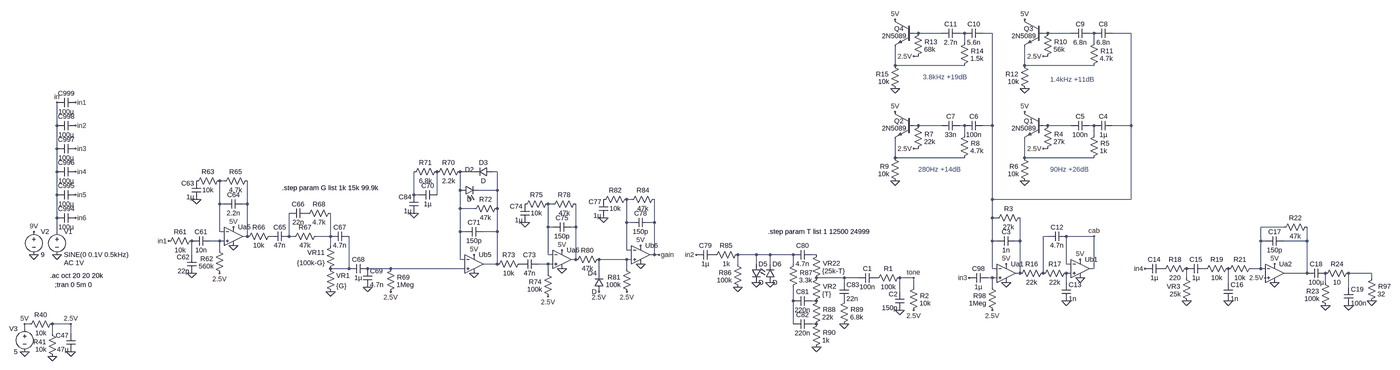
[diagram p0: schematic amPlug1ClassicRock.asc, whole sheet]
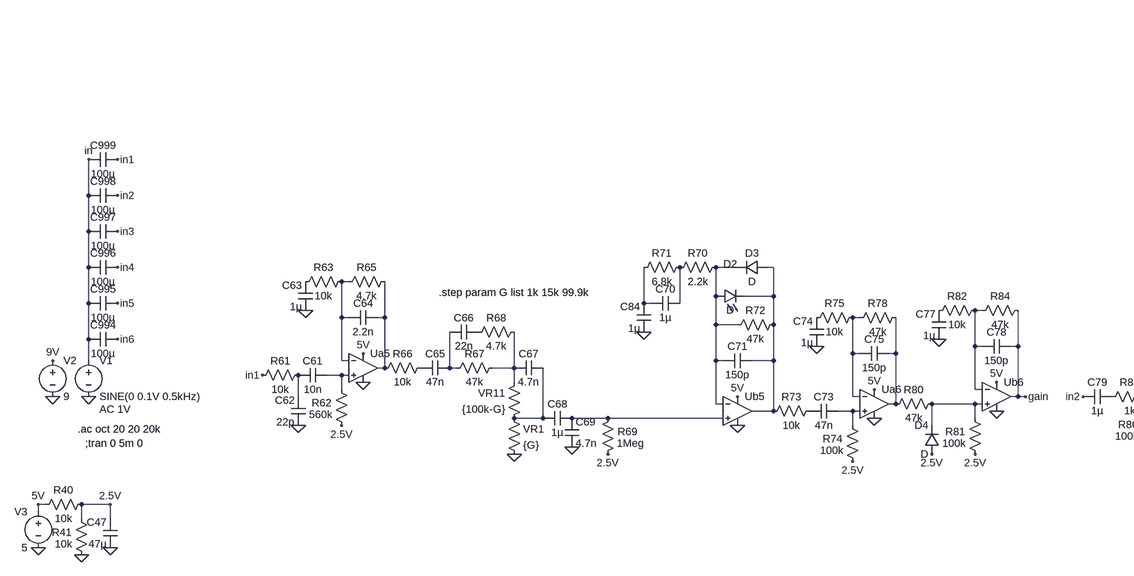
[diagram p1: schematic amPlug1ClassicRock.asc, part, row 1 of 1, column 1 of 2]
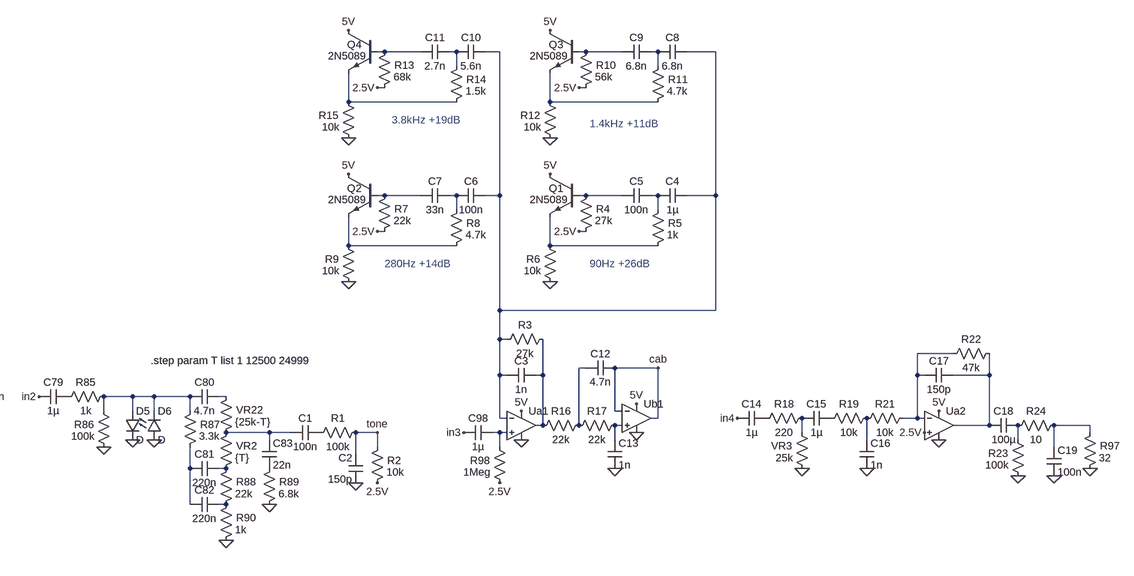
[diagram p2: schematic amPlug1ClassicRock.asc, part, row 1 of 1, column 2 of 2]
amPlug1ClassicRock.asc, the LTspice schematic file:
Version 4
SHEET 1 3408 3732
WIRE 1440 384 1424 384
WIRE 1520 384 1440 384
WIRE 1600 384 1584 384
WIRE 1696 384 1664 384
WIRE 1888 384 1872 384
WIRE 1968 384 1888 384
WIRE 2048 384 2032 384
WIRE 2176 384 2112 384
WIRE 1600 416 1600 384
WIRE 2048 416 2048 384
WIRE 1440 464 1424 464
WIRE 1888 464 1872 464
WIRE 1360 496 1360 432
WIRE 1600 496 1360 496
WIRE 1808 496 1808 432
WIRE 2048 496 1808 496
WIRE -1568 704 -1568 624
WIRE 1440 704 1424 704
WIRE 1520 704 1440 704
WIRE 1600 704 1584 704
WIRE 1696 704 1696 384
WIRE 1696 704 1664 704
WIRE 1888 704 1872 704
WIRE 1968 704 1888 704
WIRE 2048 704 2032 704
WIRE 2176 704 2176 384
WIRE 2176 704 2112 704
WIRE 1600 736 1600 704
WIRE 2048 736 2048 704
WIRE -1568 784 -1568 704
WIRE 1440 784 1424 784
WIRE 1888 784 1872 784
WIRE 1360 816 1360 752
WIRE 1600 816 1360 816
WIRE 1808 816 1808 752
WIRE 2048 816 1808 816
WIRE -1568 864 -1568 784
WIRE -96 864 -144 864
WIRE -16 864 -32 864
WIRE -960 896 -976 896
WIRE -144 928 -144 864
WIRE -16 928 -16 864
WIRE -16 928 -80 928
WIRE -1568 944 -1568 864
WIRE -304 944 -304 864
WIRE -288 944 -304 944
WIRE -224 944 -224 864
WIRE 448 960 432 960
WIRE 1696 960 1696 704
WIRE 2176 960 2176 704
WIRE 2176 960 1696 960
WIRE -976 976 -976 896
WIRE -960 976 -976 976
WIRE -880 976 -880 896
WIRE -880 976 -896 976
WIRE 176 976 160 976
WIRE -144 992 -144 928
WIRE -96 992 -144 992
WIRE -16 992 -16 928
WIRE -1568 1024 -1568 944
WIRE 1696 1024 1696 960
WIRE 1712 1024 1696 1024
WIRE 432 1040 432 960
WIRE 448 1040 432 1040
WIRE 528 1040 528 960
WIRE 528 1040 512 1040
WIRE 160 1056 160 976
WIRE 176 1056 160 1056
WIRE 256 1056 256 976
WIRE 256 1056 240 1056
WIRE 2704 1056 2624 1056
WIRE -1568 1072 -1568 1024
WIRE -976 1072 -976 976
WIRE -960 1072 -976 1072
WIRE -144 1072 -144 992
WIRE -128 1072 -144 1072
WIRE -16 1072 -16 992
WIRE -16 1072 -64 1072
WIRE -880 1088 -880 976
WIRE -880 1088 -896 1088
WIRE -736 1088 -736 1008
WIRE -720 1088 -736 1088
WIRE -592 1088 -592 1008
WIRE -592 1088 -640 1088
WIRE 1888 1088 1872 1088
WIRE 2048 1088 1952 1088
WIRE -976 1104 -1008 1104
WIRE -960 1104 -976 1104
WIRE 1696 1104 1696 1024
WIRE 1712 1104 1696 1104
WIRE 1792 1104 1792 1024
WIRE 1792 1104 1776 1104
WIRE 2624 1104 2624 1056
WIRE 2640 1104 2624 1104
WIRE 2784 1104 2784 1056
WIRE 2784 1104 2704 1104
WIRE -592 1120 -592 1088
WIRE -976 1136 -976 1104
WIRE 432 1136 432 1040
WIRE 448 1136 432 1136
WIRE -1072 1152 -1072 1104
WIRE 160 1152 160 1056
WIRE 176 1152 160 1152
WIRE 528 1152 528 1040
WIRE 528 1152 512 1152
WIRE 544 1152 528 1152
WIRE 880 1152 816 1152
WIRE 928 1152 880 1152
WIRE 1008 1152 928 1152
WIRE 1088 1152 1072 1152
WIRE -144 1168 -144 1072
WIRE -128 1168 -144 1168
WIRE 256 1168 256 1056
WIRE 256 1168 240 1168
WIRE 432 1168 336 1168
WIRE 448 1168 432 1168
WIRE -16 1184 -16 1072
WIRE -16 1184 -64 1184
WIRE 160 1184 128 1184
WIRE 176 1184 160 1184
WIRE 816 1184 816 1152
WIRE 880 1184 880 1152
WIRE 928 1184 928 1152
WIRE 1008 1184 1008 1152
WIRE 1952 1184 1952 1088
WIRE 1968 1184 1952 1184
WIRE -528 1200 -528 1088
WIRE -528 1200 -592 1200
WIRE -384 1200 -464 1200
WIRE -128 1200 -384 1200
WIRE 432 1200 432 1168
WIRE 1696 1200 1696 1104
WIRE 1712 1200 1696 1200
WIRE 2048 1200 2048 1088
WIRE 2048 1200 2032 1200
WIRE 2624 1200 2624 1104
WIRE 2624 1200 2592 1200
WIRE 2640 1200 2624 1200
WIRE 160 1216 160 1184
WIRE 336 1216 336 1168
WIRE 1792 1216 1792 1104
WIRE 1792 1216 1776 1216
WIRE 1872 1216 1872 1088
WIRE 1968 1216 1952 1216
WIRE 2784 1216 2784 1104
WIRE 2784 1216 2704 1216
WIRE 3008 1216 2928 1216
WIRE 1184 1232 1088 1232
WIRE 1232 1232 1184 1232
WIRE 1424 1232 1376 1232
WIRE 1696 1232 1680 1232
WIRE 1712 1232 1696 1232
WIRE 2368 1232 2368 1200
WIRE 3008 1232 3008 1216
WIRE 1184 1248 1184 1232
WIRE 1952 1248 1952 1216
WIRE 2512 1248 2512 1200
WIRE 2848 1248 2848 1216
WIRE 1424 1264 1424 1232
WIRE 1696 1264 1696 1232
WIRE 2928 1264 2928 1216
WIRE 1376 1280 1376 1232
WIRE 1008 1312 1008 1264
WIRE 1088 1312 1072 1312
WIRE -1664 1392 -1680 1392
WIRE -1520 1392 -1584 1392
WIRE 1008 1392 1008 1312
WIRE 1088 1392 1072 1392
WIRE -1680 1408 -1680 1392
WIRE -1584 1424 -1584 1392
WIRE -1520 1424 -1520 1392
FLAG -1568 1152 0
FLAG -1568 624 in
FLAG -1648 1152 0
FLAG -1648 1072 9V
FLAG -1504 624 in1
FLAG -1504 704 in2
FLAG -1504 784 in3
FLAG -1504 864 in4
FLAG -1504 944 in5
FLAG -1504 1024 in6
FLAG -1152 1104 in1
FLAG -928 1056 5V
FLAG -928 1120 0
FLAG -1584 1504 0
FLAG -1520 1488 0
FLAG -1520 1392 2.5V
FLAG -1056 960 0
FLAG -592 1280 0
FLAG -464 1264 0
FLAG -384 1280 2.5V
FLAG -1680 1488 0
FLAG -1680 1392 5V
FLAG -1072 1216 0
FLAG -976 1216 2.5V
FLAG -96 1152 5V
FLAG -96 1216 0
FLAG -304 1008 0
FLAG 208 1136 5V
FLAG 208 1200 0
FLAG 80 1040 0
FLAG 160 1296 2.5V
FLAG 1360 656 5V
FLAG 480 1184 0
FLAG 352 1024 0
FLAG 432 1280 2.5V
FLAG 336 1280 2.5V
FLAG 816 1264 0
FLAG 880 1248 0
FLAG 928 1248 0
FLAG 1088 1472 0
FLAG 1184 1392 0
FLAG 672 1152 in2
FLAG 1376 1344 0
FLAG 1424 1344 2.5V
FLAG 1744 1184 5V
FLAG 1744 1248 0
FLAG 1696 1344 2.5V
FLAG 1424 784 2.5V
FLAG 1360 896 0
FLAG 480 1120 5V
FLAG 1616 1232 in3
FLAG 1360 336 5V
FLAG 1424 464 2.5V
FLAG 1360 576 0
FLAG 1808 656 5V
FLAG 1872 784 2.5V
FLAG 1808 896 0
FLAG 1808 336 5V
FLAG 1872 464 2.5V
FLAG 1808 576 0
FLAG 2000 1168 5V
FLAG 2000 1232 0
FLAG 1952 1312 0
FLAG 2512 1312 0
FLAG 2368 1312 0
FLAG 2672 1184 5V
FLAG 2672 1248 0
FLAG 2640 1232 2.5V
FLAG 2848 1328 0
FLAG 2928 1328 0
FLAG 2224 1200 in4
FLAG 3008 1312 0
FLAG 544 1152 gain
FLAG 1424 1232 tone
FLAG 2048 1088 cab
SYMBOL voltage -1568 1056 R0
WINDOW 123 24 124 Left 2
WINDOW 39 0 0 Left 2
SYMATTR Value2 AC 1V
SYMATTR InstName V1
SYMATTR Value SINE(0 0.1V 0.5kHz)
SYMBOL voltage -1648 1056 R0
WINDOW 123 0 0 Left 0
WINDOW 39 0 0 Left 0
SYMATTR InstName V2
SYMATTR Value 9
SYMBOL cap -1504 688 R90
WINDOW 0 0 32 VBottom 2
WINDOW 3 32 32 VTop 2
SYMATTR InstName C998
SYMATTR Value 100µ
SYMBOL cap -1504 768 R90
WINDOW 0 0 32 VBottom 2
WINDOW 3 32 32 VTop 2
SYMATTR InstName C997
SYMATTR Value 100µ
SYMBOL cap -1504 848 R90
WINDOW 0 0 32 VBottom 2
WINDOW 3 32 32 VTop 2
SYMATTR InstName C996
SYMATTR Value 100µ
SYMBOL cap -1504 608 R90
WINDOW 0 0 32 VBottom 2
WINDOW 3 32 32 VTop 2
SYMATTR InstName C999
SYMATTR Value 100µ
SYMBOL cap -1504 928 R90
WINDOW 0 0 32 VBottom 2
WINDOW 3 32 32 VTop 2
SYMATTR InstName C995
SYMATTR Value 100µ
SYMBOL cap -1504 1008 R90
WINDOW 0 0 32 VBottom 2
WINDOW 3 32 32 VTop 2
SYMATTR InstName C994
SYMATTR Value 100µ
SYMBOL cap -1008 1088 R90
WINDOW 0 0 32 VBottom 2
WINDOW 3 32 32 VTop 2
SYMATTR InstName C61
SYMATTR Value 10n
SYMBOL res -1056 1088 R90
WINDOW 0 0 56 VBottom 2
WINDOW 3 32 56 VTop 2
SYMATTR InstName R61
SYMATTR Value 10k
SYMBOL Opamps\\UniversalOpamp2 -928 1088 R0
SYMATTR InstName Ua5
SYMBOL cap -896 960 R90
WINDOW 0 0 32 VBottom 2
WINDOW 3 32 32 VTop 2
SYMATTR InstName C64
SYMATTR Value 2.2n
SYMBOL res -864 880 R90
WINDOW 0 0 56 VBottom 2
WINDOW 3 32 56 VTop 2
SYMATTR InstName R65
SYMATTR Value 4.7k
SYMBOL res -1568 1376 R90
WINDOW 0 0 56 VBottom 2
WINDOW 3 32 56 VTop 2
SYMATTR InstName R40
SYMATTR Value 10k
SYMBOL res -1568 1520 R180
WINDOW 0 38 66 Left 2
WINDOW 3 36 40 Left 2
SYMATTR InstName R41
SYMATTR Value 10k
SYMBOL cap -1504 1488 R180
WINDOW 0 24 56 Left 2
WINDOW 3 24 8 Left 2
SYMATTR InstName C47
SYMATTR Value 47µ
SYMBOL res -960 1232 R180
WINDOW 0 38 66 Left 2
WINDOW 3 36 40 Left 2
SYMATTR InstName R62
SYMATTR Value 560k
SYMBOL res -960 880 R90
WINDOW 0 0 56 VBottom 2
WINDOW 3 32 56 VTop 2
SYMATTR InstName R63
SYMATTR Value 10k
SYMBOL cap -1040 960 R180
WINDOW 0 24 56 Left 2
WINDOW 3 24 8 Left 2
SYMATTR InstName C63
SYMATTR Value 1µ
SYMBOL npn 1424 656 M0
WINDOW 0 35 32 Left 2
WINDOW 3 25 57 Left 2
SYMATTR InstName Q2
SYMATTR Value 2N5089
SYMBOL res -784 1072 R90
WINDOW 0 0 56 VBottom 2
WINDOW 3 32 56 VTop 2
SYMATTR InstName R66
SYMATTR Value 10k
SYMBOL cap -736 1072 R90
WINDOW 0 0 32 VBottom 2
WINDOW 3 32 32 VTop 2
SYMATTR InstName C65
SYMATTR Value 47n
SYMBOL res -624 1072 R90
WINDOW 0 0 56 VBottom 2
WINDOW 3 32 56 VTop 2
SYMATTR InstName R67
SYMATTR Value 47k
SYMBOL cap -672 992 R90
WINDOW 0 0 32 VBottom 2
WINDOW 3 32 32 VTop 2
SYMATTR InstName C66
SYMATTR Value 22n
SYMBOL res -576 992 R90
WINDOW 0 0 56 VBottom 2
WINDOW 3 32 56 VTop 2
SYMATTR InstName R68
SYMATTR Value 4.7k
SYMBOL cap -528 1072 R90
WINDOW 0 0 32 VBottom 2
WINDOW 3 32 32 VTop 2
SYMATTR InstName C67
SYMATTR Value 4.7n
SYMBOL res -576 1104 M0
SYMATTR InstName VR11
SYMATTR Value {100k-G}
SYMBOL res -608 1184 R0
SYMATTR InstName VR1
SYMATTR Value {G}
SYMBOL cap -464 1184 R90
WINDOW 0 0 32 VBottom 2
WINDOW 3 32 32 VTop 2
SYMATTR InstName C68
SYMATTR Value 1µ
SYMBOL cap -480 1264 M180
WINDOW 0 24 56 Left 2
WINDOW 3 24 8 Left 2
SYMATTR InstName C69
SYMATTR Value 4.7n
SYMBOL res -400 1296 M180
WINDOW 0 38 66 Left 2
WINDOW 3 36 40 Left 2
SYMATTR InstName R69
SYMATTR Value 1Meg
SYMBOL voltage -1680 1392 M0
WINDOW 123 0 0 Left 0
WINDOW 39 0 0 Left 0
SYMATTR InstName V3
SYMATTR Value 5
SYMBOL cap -1056 1216 R180
WINDOW 0 24 56 Left 2
WINDOW 3 24 8 Left 2
SYMATTR InstName C62
SYMATTR Value 22p
SYMBOL Opamps\\UniversalOpamp2 -96 1184 R0
SYMATTR InstName Ub5
SYMBOL cap -64 1056 R90
WINDOW 0 0 32 VBottom 2
WINDOW 3 32 32 VTop 2
SYMATTR InstName C71
SYMATTR Value 150p
SYMBOL res 0 976 R90
WINDOW 0 0 56 VBottom 2
WINDOW 3 32 56 VTop 2
SYMATTR InstName R72
SYMATTR Value 47k
SYMBOL res -128 848 R90
WINDOW 0 0 56 VBottom 2
WINDOW 3 32 56 VTop 2
SYMATTR InstName R70
SYMATTR Value 2.2k
SYMBOL cap -288 1008 R180
WINDOW 0 24 56 Left 2
WINDOW 3 24 8 Left 2
SYMATTR InstName C84
SYMATTR Value 1µ
SYMBOL diode -32 848 R90
WINDOW 0 0 32 VBottom 2
WINDOW 3 32 32 VTop 2
SYMATTR InstName D3
SYMBOL LED -144 944 R270
WINDOW 0 72 32 VTop 2
WINDOW 3 0 32 VBottom 2
SYMATTR InstName D2
SYMBOL cap -288 960 R270
WINDOW 0 32 32 VTop 2
WINDOW 3 0 32 VBottom 2
SYMATTR InstName C70
SYMATTR Value 1µ
SYMBOL res -208 848 R90
WINDOW 0 0 56 VBottom 2
WINDOW 3 32 56 VTop 2
SYMATTR InstName R71
SYMATTR Value 6.8k
SYMBOL cap 128 1168 R90
WINDOW 0 0 32 VBottom 2
WINDOW 3 32 32 VTop 2
SYMATTR InstName C73
SYMATTR Value 47n
SYMBOL Opamps\\UniversalOpamp2 208 1168 R0
SYMATTR InstName Ua6
SYMBOL cap 240 1040 R90
WINDOW 0 0 32 VBottom 2
WINDOW 3 32 32 VTop 2
SYMATTR InstName C75
SYMATTR Value 150p
SYMBOL res 272 960 R90
WINDOW 0 0 56 VBottom 2
WINDOW 3 32 56 VTop 2
SYMATTR InstName R78
SYMATTR Value 47k
SYMBOL res 176 1312 R180
WINDOW 0 38 66 Left 2
WINDOW 3 36 40 Left 2
SYMATTR InstName R74
SYMATTR Value 100k
SYMBOL res 176 960 R90
WINDOW 0 0 56 VBottom 2
WINDOW 3 32 56 VTop 2
SYMATTR InstName R75
SYMATTR Value 10k
SYMBOL cap 96 1040 R180
WINDOW 0 24 56 Left 2
WINDOW 3 24 8 Left 2
SYMATTR InstName C74
SYMATTR Value 1µ
SYMBOL res 80 1168 R90
WINDOW 0 0 56 VBottom 2
WINDOW 3 32 56 VTop 2
SYMATTR InstName R73
SYMATTR Value 10k
SYMBOL Opamps\\UniversalOpamp2 480 1152 R0
SYMATTR InstName Ub6
SYMBOL cap 512 1024 R90
WINDOW 0 0 32 VBottom 2
WINDOW 3 32 32 VTop 2
SYMATTR InstName C78
SYMATTR Value 150p
SYMBOL res 544 944 R90
WINDOW 0 0 56 VBottom 2
WINDOW 3 32 56 VTop 2
SYMATTR InstName R84
SYMATTR Value 47k
SYMBOL res 448 1296 R180
WINDOW 0 38 66 Left 2
WINDOW 3 36 40 Left 2
SYMATTR InstName R81
SYMATTR Value 100k
SYMBOL res 448 944 R90
WINDOW 0 0 56 VBottom 2
WINDOW 3 32 56 VTop 2
SYMATTR InstName R82
SYMATTR Value 10k
SYMBOL cap 368 1024 R180
WINDOW 0 24 56 Left 2
WINDOW 3 24 8 Left 2
SYMATTR InstName C77
SYMATTR Value 1µ
SYMBOL diode 352 1280 R180
WINDOW 0 24 64 Left 2
WINDOW 3 24 0 Left 2
SYMATTR InstName D4
SYMBOL res 352 1152 R90
WINDOW 0 0 56 VBottom 2
WINDOW 3 32 56 VTop 2
SYMATTR InstName R80
SYMATTR Value 47k
SYMBOL cap 736 1136 R90
WINDOW 0 0 32 VBottom 2
WINDOW 3 32 32 VTop 2
SYMATTR InstName C79
SYMATTR Value 1µ
SYMBOL res 832 1136 R90
WINDOW 0 0 56 VBottom 2
WINDOW 3 32 56 VTop 2
SYMATTR InstName R85
SYMATTR Value 1k
SYMBOL res 832 1280 R180
WINDOW 0 38 66 Left 2
WINDOW 3 36 40 Left 2
SYMATTR InstName R86
SYMATTR Value 100k
SYMBOL diode 864 1184 R0
SYMATTR InstName D5
SYMBOL LED 912 1248 M180
WINDOW 0 24 64 Left 2
WINDOW 3 24 0 Left 2
SYMATTR InstName D6
SYMBOL cap 1072 1136 R90
WINDOW 0 0 32 VBottom 2
WINDOW 3 32 32 VTop 2
SYMATTR InstName C80
SYMATTR Value 4.7n
SYMBOL res 992 1280 M180
WINDOW 0 38 66 Left 2
WINDOW 3 36 40 Left 2
SYMATTR InstName R87
SYMATTR Value 3.3k
SYMBOL cap 1072 1296 R90
WINDOW 0 0 32 VBottom 2
WINDOW 3 32 32 VTop 2
SYMATTR InstName C81
SYMATTR Value 220n
SYMBOL cap 1072 1376 R90
WINDOW 0 0 32 VBottom 2
WINDOW 3 32 32 VTop 2
SYMATTR InstName C82
SYMATTR Value 220n
SYMBOL res 1072 1408 M180
WINDOW 0 38 66 Left 2
WINDOW 3 36 40 Left 2
SYMATTR InstName R88
SYMATTR Value 22k
SYMBOL res 1072 1488 M180
WINDOW 0 38 66 Left 2
WINDOW 3 36 40 Left 2
SYMATTR InstName R90
SYMATTR Value 1k
SYMBOL res 1072 1328 M180
WINDOW 0 38 66 Left 2
WINDOW 3 36 40 Left 2
SYMATTR InstName VR2
SYMATTR Value {T}
SYMBOL res 1072 1248 M180
WINDOW 0 38 66 Left 2
WINDOW 3 36 40 Left 2
SYMATTR InstName VR22
SYMATTR Value {25k-T}
SYMBOL cap 1168 1312 M180
WINDOW 0 24 56 Left 2
WINDOW 3 24 8 Left 2
SYMATTR InstName C83
SYMATTR Value 22n
SYMBOL res 1168 1408 M180
WINDOW 0 38 66 Left 2
WINDOW 3 36 40 Left 2
SYMATTR InstName R89
SYMATTR Value 6.8k
SYMBOL cap 1296 1216 R90
WINDOW 0 0 32 VBottom 2
WINDOW 3 32 32 VTop 2
SYMATTR InstName C1
SYMATTR Value 100n
SYMBOL res 1392 1216 R90
WINDOW 0 0 56 VBottom 2
WINDOW 3 32 56 VTop 2
SYMATTR InstName R1
SYMATTR Value 100k
SYMBOL cap 1392 1344 R180
WINDOW 0 24 56 Left 2
WINDOW 3 24 8 Left 2
SYMATTR InstName C2
SYMATTR Value 150p
SYMBOL res 1408 1360 M180
WINDOW 0 38 66 Left 2
WINDOW 3 36 40 Left 2
SYMATTR InstName R2
SYMATTR Value 10k
SYMBOL Opamps\\UniversalOpamp2 1744 1216 R0
SYMATTR InstName Ua1
SYMBOL cap 1776 1088 R90
WINDOW 0 0 32 VBottom 2
WINDOW 3 32 32 VTop 2
SYMATTR InstName C3
SYMATTR Value 1n
SYMBOL res 1808 1008 R90
WINDOW 0 0 56 VBottom 2
WINDOW 3 32 56 VTop 2
SYMATTR InstName R3
SYMATTR Value 27k
SYMBOL res 1712 1360 R180
WINDOW 0 38 66 Left 2
WINDOW 3 36 40 Left 2
SYMATTR InstName R98
SYMATTR Value 1Meg
SYMBOL cap 1680 1216 R90
WINDOW 0 0 32 VBottom 2
WINDOW 3 32 32 VTop 2
SYMATTR InstName C98
SYMATTR Value 1µ
SYMBOL res 1376 912 R180
WINDOW 0 38 66 Left 2
WINDOW 3 36 40 Left 2
SYMATTR InstName R9
SYMATTR Value 10k
SYMBOL res 1424 800 M180
WINDOW 0 38 66 Left 2
WINDOW 3 36 40 Left 2
SYMATTR InstName R7
SYMATTR Value 22k
SYMBOL cap 1584 688 R90
WINDOW 0 0 32 VBottom 2
WINDOW 3 32 32 VTop 2
SYMATTR InstName C7
SYMATTR Value 33n
SYMBOL cap 1664 688 R90
WINDOW 0 0 32 VBottom 2
WINDOW 3 32 32 VTop 2
SYMATTR InstName C6
SYMATTR Value 100n
SYMBOL res 1584 832 M180
WINDOW 0 38 66 Left 2
WINDOW 3 36 40 Left 2
SYMATTR InstName R8
SYMATTR Value 4.7k
SYMBOL npn 1424 336 M0
WINDOW 0 35 32 Left 2
WINDOW 3 25 57 Left 2
SYMATTR InstName Q4
SYMATTR Value 2N5089
SYMBOL res 1376 592 R180
WINDOW 0 38 66 Left 2
WINDOW 3 36 40 Left 2
SYMATTR InstName R15
SYMATTR Value 10k
SYMBOL res 1424 480 M180
WINDOW 0 38 66 Left 2
WINDOW 3 36 40 Left 2
SYMATTR InstName R13
SYMATTR Value 68k
SYMBOL cap 1584 368 R90
WINDOW 0 0 32 VBottom 2
WINDOW 3 32 32 VTop 2
SYMATTR InstName C11
SYMATTR Value 2.7n
SYMBOL cap 1664 368 R90
WINDOW 0 0 32 VBottom 2
WINDOW 3 32 32 VTop 2
SYMATTR InstName C10
SYMATTR Value 5.6n
SYMBOL res 1584 512 M180
WINDOW 0 38 66 Left 2
WINDOW 3 36 40 Left 2
SYMATTR InstName R14
SYMATTR Value 1.5k
SYMBOL npn 1872 656 M0
WINDOW 0 35 32 Left 2
WINDOW 3 25 57 Left 2
SYMATTR InstName Q1
SYMATTR Value 2N5089
SYMBOL res 1824 912 R180
WINDOW 0 38 66 Left 2
WINDOW 3 36 40 Left 2
SYMATTR InstName R6
SYMATTR Value 10k
SYMBOL res 1872 800 M180
WINDOW 0 38 66 Left 2
WINDOW 3 36 40 Left 2
SYMATTR InstName R4
SYMATTR Value 27k
SYMBOL cap 2032 688 R90
WINDOW 0 0 32 VBottom 2
WINDOW 3 32 32 VTop 2
SYMATTR InstName C5
SYMATTR Value 100n
SYMBOL cap 2112 688 R90
WINDOW 0 0 32 VBottom 2
WINDOW 3 32 32 VTop 2
SYMATTR InstName C4
SYMATTR Value 1µ
SYMBOL res 2032 832 M180
WINDOW 0 38 66 Left 2
WINDOW 3 36 40 Left 2
SYMATTR InstName R5
SYMATTR Value 1k
SYMBOL npn 1872 336 M0
WINDOW 0 35 32 Left 2
WINDOW 3 25 57 Left 2
SYMATTR InstName Q3
SYMATTR Value 2N5089
SYMBOL res 1824 592 R180
WINDOW 0 38 66 Left 2
WINDOW 3 36 40 Left 2
SYMATTR InstName R12
SYMATTR Value 10k
SYMBOL res 1872 480 M180
WINDOW 0 38 66 Left 2
WINDOW 3 36 40 Left 2
SYMATTR InstName R10
SYMATTR Value 56k
SYMBOL cap 2032 368 R90
WINDOW 0 0 32 VBottom 2
WINDOW 3 32 32 VTop 2
SYMATTR InstName C9
SYMATTR Value 6.8n
SYMBOL cap 2112 368 R90
WINDOW 0 0 32 VBottom 2
WINDOW 3 32 32 VTop 2
SYMATTR InstName C8
SYMATTR Value 6.8n
SYMBOL res 2032 512 M180
WINDOW 0 38 66 Left 2
WINDOW 3 36 40 Left 2
SYMATTR InstName R11
SYMATTR Value 4.7k
SYMBOL Opamps\\UniversalOpamp2 2000 1200 R0
SYMATTR InstName Ub1
SYMBOL cap 1936 1312 M180
WINDOW 0 24 56 Left 2
WINDOW 3 24 8 Left 2
SYMATTR InstName C13
SYMATTR Value 1n
SYMBOL cap 1952 1072 R90
WINDOW 0 0 32 VBottom 2
WINDOW 3 32 32 VTop 2
SYMATTR InstName C12
SYMATTR Value 4.7n
SYMBOL res 1968 1200 R90
WINDOW 0 0 56 VBottom 2
WINDOW 3 32 56 VTop 2
SYMATTR InstName R17
SYMATTR Value 22k
SYMBOL res 1888 1200 R90
WINDOW 0 0 56 VBottom 2
WINDOW 3 32 56 VTop 2
SYMATTR InstName R16
SYMATTR Value 22k
SYMBOL cap 2432 1184 R90
WINDOW 0 0 32 VBottom 2
WINDOW 3 32 32 VTop 2
SYMATTR InstName C15
SYMATTR Value 1µ
SYMBOL res 2528 1184 R90
WINDOW 0 0 56 VBottom 2
WINDOW 3 32 56 VTop 2
SYMATTR InstName R19
SYMATTR Value 10k
SYMBOL res 2608 1184 R90
WINDOW 0 0 56 VBottom 2
WINDOW 3 32 56 VTop 2
SYMATTR InstName R21
SYMATTR Value 10k
SYMBOL cap 2496 1312 M180
WINDOW 0 24 56 Left 2
WINDOW 3 24 8 Left 2
SYMATTR InstName C16
SYMATTR Value 1n
SYMBOL res 2384 1184 R90
WINDOW 0 0 56 VBottom 2
WINDOW 3 32 56 VTop 2
SYMATTR InstName R18
SYMATTR Value 220
SYMBOL cap 2288 1184 R90
WINDOW 0 0 32 VBottom 2
WINDOW 3 32 32 VTop 2
SYMATTR InstName C14
SYMATTR Value 1µ
SYMBOL res 2384 1328 R180
WINDOW 0 38 66 Left 2
WINDOW 3 36 40 Left 2
SYMATTR InstName VR3
SYMATTR Value 25k
SYMBOL Opamps\\UniversalOpamp2 2672 1216 R0
SYMATTR InstName Ua2
SYMBOL cap 2704 1088 R90
WINDOW 0 0 32 VBottom 2
WINDOW 3 32 32 VTop 2
SYMATTR InstName C17
SYMATTR Value 150p
SYMBOL res 2800 1040 R90
WINDOW 0 0 56 VBottom 2
WINDOW 3 32 56 VTop 2
SYMATTR InstName R22
SYMATTR Value 47k
SYMBOL cap 2848 1200 R90
WINDOW 0 0 32 VBottom 2
WINDOW 3 32 32 VTop 2
SYMATTR InstName C18
SYMATTR Value 100µ
SYMBOL res 2864 1344 R180
WINDOW 0 38 66 Left 2
WINDOW 3 36 40 Left 2
SYMATTR InstName R23
SYMATTR Value 100k
SYMBOL res 2944 1200 R90
WINDOW 0 0 56 VBottom 2
WINDOW 3 32 56 VTop 2
SYMATTR InstName R24
SYMATTR Value 10
SYMBOL cap 2912 1328 M180
WINDOW 0 24 56 Left 2
WINDOW 3 24 8 Left 2
SYMATTR InstName C19
SYMATTR Value 100n
SYMBOL res 2992 1328 M180
WINDOW 0 38 66 Left 2
WINDOW 3 36 40 Left 2
SYMATTR InstName R97
SYMATTR Value 32
TEXT -1592 1224 Left 2 !.ac oct 20 20 20k
TEXT -1576 1256 Left 2 !;tran 0 5m 0
TEXT -760 920 Left 2 !.step param G list 1k 15k 99.9k
TEXT 920 1072 Left 2 !.step param T list 1 12500 24999
TEXT 1896 856 Left 2 ;90Hz +26dB
TEXT 1440 856 Left 2 ;280Hz +14dB
TEXT 1456 536 Left 2 ;3.8kHz +19dB
TEXT 1896 544 Left 2 ;1.4kHz +11dB

The netlist it stands for:
* amPlug1ClassicRock.asc
V1 in 0 SINE(0 0.1V 0.5kHz) AC 1V
V2 9V 0 9
C998 in2 in 100µ
C997 in3 in 100µ
C996 in4 in 100µ
C999 in1 in 100µ
C995 in5 in 100µ
C994 in6 in 100µ
C61 N027 N030 10n
R61 N030 in1 10k
XUa5 N027 N016 5V 0 N020 level.2 Avol=1Meg GBW=10Meg Slew=10Meg ilimit=25m rail=0 Vos=0 phimargin=45 en=0 enk=0 in=0 ink=0 Rin=500Meg  ; pins IN+ IN- V+ V- OUT
C64 N020 N016 2.2n
R65 N020 N016 4.7k
R40 2.5V 5V 10k
R41 0 2.5V 10k
C47 0 2.5V 47µ
R62 2.5V N027 560k
R63 N016 P001 10k
C63 0 P001 1µ
Q2 5V N008 N012 0 2N5089
R66 P002 N020 10k
C65 N024 P002 47n
R67 N025 N024 47k
C66 P003 N024 22n
R68 N025 P003 4.7k
C67 N035 N025 4.7n
R§VR11 N025 N035 {100k-G}
R§VR1 N035 0 {G}
C68 N036 N035 1µ
C69 0 N036 4.7n
R69 2.5V N036 1Meg
V3 5V 0 5
C62 0 N030 22p
XUb5 N036 N014 5V 0 N015 level.2 Avol=1Meg GBW=10Meg Slew=10Meg ilimit=25m rail=0 Vos=0 phimargin=45 en=0 enk=0 in=0 ink=0 Rin=500Meg  ; pins IN+ IN- V+ V- OUT
C71 N015 N014 150p
R72 N015 N014 47k
R70 N014 N018 2.2k
C84 0 N017 1µ
D3 N015 N014 D
D2 N014 N015 D
C70 N017 N018 1µ
R71 N018 N017 6.8k
C73 N034 P004 47n
XUa6 N034 N021 5V 0 N022 level.2 Avol=1Meg GBW=10Meg Slew=10Meg ilimit=25m rail=0 Vos=0 phimargin=45 en=0 enk=0 in=0 ink=0 Rin=500Meg  ; pins IN+ IN- V+ V- OUT
C75 N022 N021 150p
R78 N022 N021 47k
R74 2.5V N034 100k
R75 N021 P005 10k
C74 0 P005 1µ
R73 P004 N015 10k
XUb6 N033 N019 5V 0 gain level.2 Avol=1Meg GBW=10Meg Slew=10Meg ilimit=25m rail=0 Vos=0 phimargin=45 en=0 enk=0 in=0 ink=0 Rin=500Meg  ; pins IN+ IN- V+ V- OUT
C78 gain N019 150p
R84 gain N019 47k
R81 2.5V N033 100k
R82 N019 P006 10k
C77 0 P006 1µ
D4 2.5V N033 D
R80 N033 N022 47k
C79 P007 in2 1µ
R85 N031 P007 1k
R86 0 N031 100k
D5 N031 0 D
D6 0 N031 D
C80 N032 N031 4.7n
R87 N044 N031 3.3k
C81 N045 N044 220n
C82 N046 N044 220n
R88 N046 N045 22k
R90 0 N046 1k
R§VR2 N045 N039 {T}
R§VR22 N039 N032 {25k-T}
C83 P008 N039 22n
R89 0 P008 6.8k
C1 P009 N039 100n
R1 tone P009 100k
C2 0 tone 150p
R2 2.5V tone 10k
XUa1 N040 N003 5V 0 N028 level.2 Avol=1Meg GBW=10Meg Slew=10Meg ilimit=25m rail=0 Vos=0 phimargin=45 en=0 enk=0 in=0 ink=0 Rin=500Meg  ; pins IN+ IN- V+ V- OUT
C3 N028 N003 1n
R3 N028 N003 27k
R98 2.5V N040 1Meg
C98 N040 in3 1µ
R9 0 N012 10k
R7 2.5V N008 22k
C7 N009 N008 33n
C6 N003 N009 100n
R8 N012 N009 4.7k
Q4 5V N001 N006 0 2N5089
R15 0 N006 10k
R13 2.5V N001 68k
C11 N002 N001 2.7n
C10 N003 N002 5.6n
R14 N006 N002 1.5k
Q1 5V N010 N013 0 2N5089
R6 0 N013 10k
R4 2.5V N010 27k
C5 N011 N010 100n
C4 N003 N011 1µ
R5 N013 N011 1k
Q3 5V N004 N007 0 2N5089
R12 0 N007 10k
R10 2.5V N004 56k
C9 N005 N004 6.8n
C8 N003 N005 6.8n
R11 N007 N005 4.7k
XUb1 N037 cab 5V 0 cab level.2 Avol=1Meg GBW=10Meg Slew=10Meg ilimit=25m rail=0 Vos=0 phimargin=45 en=0 enk=0 in=0 ink=0 Rin=500Meg  ; pins IN+ IN- V+ V- OUT
C13 0 N037 1n
C12 cab N026 4.7n
R17 N037 N026 22k
R16 N026 N028 22k
C15 P010 N041 1µ
R19 N042 P010 10k
R21 N023 N042 10k
C16 0 N042 1n
R18 N041 P011 220
C14 P011 in4 1µ
R§VR3 0 N041 25k
XUa2 2.5V N023 5V 0 N029 level.2 Avol=1Meg GBW=10Meg Slew=10Meg ilimit=25m rail=0 Vos=0 phimargin=45 en=0 enk=0 in=0 ink=0 Rin=500Meg  ; pins IN+ IN- V+ V- OUT
C17 N029 N023 150p
R22 N029 N023 47k
C18 N043 N029 100µ
R23 0 N043 100k
R24 N038 N043 10
C19 0 N038 100n
R97 0 N038 32
.model D D
.lib standard.dio
.model NPN NPN
.model PNP PNP
.lib standard.bjt
.ac oct 20 20 20k
;tran 0 5m 0
.step param G list 1k 15k 99.9k
.step param T list 1 12500 24999
* 90Hz +26dB
* 280Hz +14dB
* 3.8kHz +19dB
* 1.4kHz +11dB
.lib UniversalOpamps2.sub
.backanno
.end